# Altium project Super_Hornet_1.0.PrjPcb (part 2 of 5)
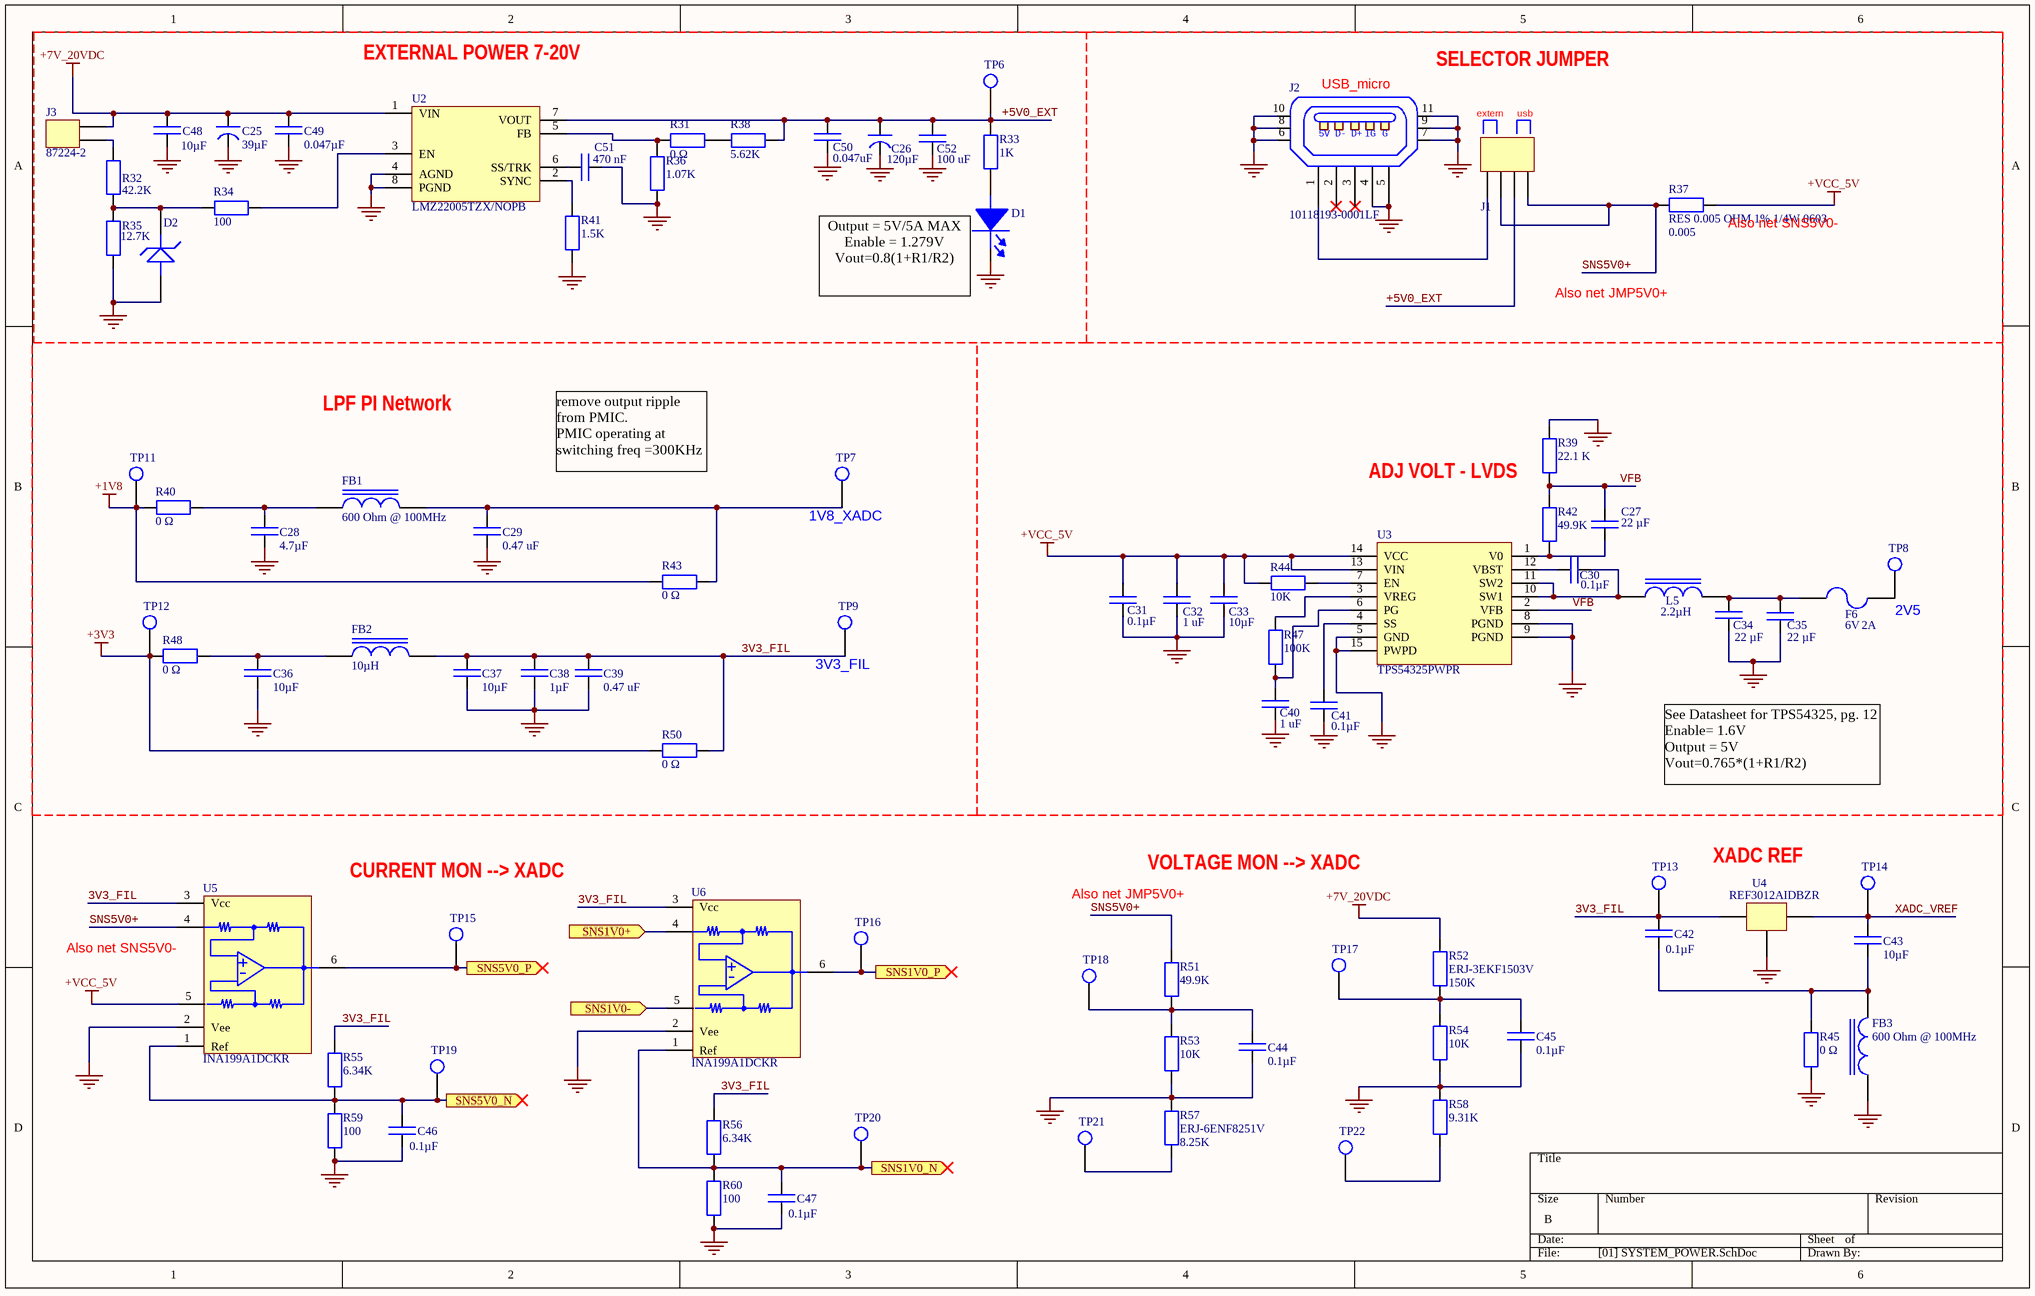
[diagram p3: [01] SYSTEM_POWER.SchDoc]

## Sheet [01] SYSTEM_POWER.SchDoc (continued)
### Library data of the parts
C25 = 35SVPF39M: CAP ALUM POLY 39UF 20% 35V SMD; Manufacturer: Panasonic; Featured Product: OS-CON Capacitors Hot New Technologies; EDA / CAD Models: Download from Accelerated Designs; ESR (Equivalent Series Resistance): 30 mOhm; Lifetime @ Temp.: 5000 Hrs @ 105°C; Polarization: Polar; Ripple Current: 2.8A; Surface Mount Land Size: 0.327" L x 0.327" W (8.30mm x 8.30mm); Online Catalog: OS-CON, SVPF Series; Other Names: P16561TR; Supplier 1: Digi-Key; Manufacturer Part Number: 35SVPF39M; Stock 1: 6908; Pricing 1: 1=1.51, 10=1.191, 100=0.8935, 500=0.6751 (USD); Standard Package: 1,000; Category: Capacitors; Family: Aluminum - Polymer Capacitors; Series: OS-CON, SVPF; Packaging: Tape & Reel (TR); Tolerance: ±20%; Voltage Rating: 35V; Operating Temperature: -55°C ~ 105°C; Size / Dimension: 0.315" Dia (8.00mm); Height - Seated (Max): 0.276" (7.00mm); Mounting Type: Surface Mount; Package / Case: Radial, Can - SMD; ComponentLink1URL: http://www.mouser.com/ds/2/315/AAB8000C177-947360.pdf?src-supplier=Mouser; ComponentLink1Description: http://www.mouser.com/ds/2/315/AAB8000C177-947360.pdf?src-supplier=Mouser; ComponentLink2URL: http://industrial.panasonic.com/cdbs/www-data/pdf/AAB8000/AAB8000C177.pdf?src-supplier=Element14; ComponentLink2Description: http://industrial.panasonic.com/cdbs/www-data/pdf/AAB8000/AAB8000C177.pdf?src-supplier=Element14; Supplier Part Number 1: P16561CT-ND
C26 = 20SVPF120M: CAP ALUM POLY 120UF 20% 20V SMD; Manufacturer: Panasonic; Featured Product: OS-CON Capacitors Hot New Technologies; EDA / CAD Models: Download from Accelerated Designs; ESR (Equivalent Series Resistance): 25 mOhm; Lifetime @ Temp.: 5000 Hrs @ 105°C; Polarization: Polar; Ripple Current: 3.2A; Surface Mount Land Size: 0.260" L x 0.260" W (6.60mm x 6.60mm); Online Catalog: OS-CON, SVPF Series; Other Names: P16498TR; Supplier 1: Digi-Key; Manufacturer Part Number: 20SVPF120M; Stock 1: 156; Pricing 1: 1=1.29, 10=1.022, 100=0.7662, 500=0.5789 (USD); Standard Package: 1,000; Category: Capacitors; Family: Aluminum - Polymer Capacitors; Series: OS-CON, SVPF; Packaging: Tape & Reel (TR); Tolerance: ±20%; Voltage Rating: 20V; Operating Temperature: -55°C ~ 105°C; Size / Dimension: 0.248" Dia (6.30mm); Height - Seated (Max): 0.236" (6.00mm); Mounting Type: Surface Mount; Package / Case: Radial, Can - SMD; ComponentLink1URL: http://industrial.panasonic.com/cdbs/www-data/pdf/AAB8000/AAB8000C177.pdf?src-supplier=Farnell; ComponentLink1Description: http://industrial.panasonic.com/cdbs/www-data/pdf/AAB8000/AAB8000C177.pdf?src-supplier=Farnell; ComponentLink2URL: http://www.alliedelec.com/images/products/datasheets/bm/Panasonic/70324301.pdf?src-supplier=Allied+Electronics; ComponentLink2Description: http://www.alliedelec.com/images/products/datasheets/bm/Panasonic/70324301.pdf?src-supplier=Allied+Electronics; ComponentLink3URL: http://www.farnell.com/datasheets/1734360.pdf?src-supplier=Element14; ComponentLink3Description: http://www.farnell.com/datasheets/1734360.pdf?src-supplier=Element14; Supplier Part Number 1: P16498CT-ND
C27 C34 C35 = 12063D226KAT2A: CAP CER 22UF 25V X5R 1206; Manufacturer: Kyocera AVX; Tolerance (%): ±10 %; Supplier 1: Digi-Key; Manufacturer Part Number: 12063D226KAT2A; Stock 1: 100747; Pricing 1: 1=1.15, 10=0.909, 100=0.6814, 500=0.5148, 1000=0.4543 (USD); Case Size/Dimension: 1206; Dielectric: X5R; Rated Voltage: 25 V; ComponentLink1URL: http://www.avx.com/docs/Catalogs/cx5r.pdf?src-supplier=Future+Electronics; ComponentLink1Description: http://www.avx.com/docs/Catalogs/cx5r.pdf?src-supplier=Future+Electronics; Supplier Part Number 1: 478-9946-1-ND
C28 = C2012X5R1C475K060AC: CAP CER 4.7UF 16V X5R 0805; Manufacturer: TDK; Product Training Modules: C Series General Applications SEAT, CCV, and TVCL Design Tools Guide to Replacing an Electrolytic Capacitor with an MLCC; EDA / CAD Models: Download from Accelerated Designs; Tolerance: ±10%; Online Catalog: C Series, General Purpose; Other Names: 445-14381-6; Supplier 1: Digi-Key; Manufacturer Part Number: C2012X5R1C475K060AC; Stock 1: 30385; Pricing 1: 1=0.5, 10=0.348, 100=0.2087, 500=0.1565, 1000=0.1322 (USD); RoHS Information: RoHS Certificate-MLCC; Standard Package: 1; Category: Capacitors; Family: Ceramic Capacitors; Series: C; Packaging: Digi-Reel®; Voltage - Rated: 16V; Temperature Coefficient: X5R; Mounting Type: Surface Mount, MLCC; Operating Temperature: -55°C ~ 85°C; Applications: General Purpose; Package / Case: 0805 (2012 Metric); Size / Dimension: 0.079" L x 0.049" W (2.00mm x 1.25mm); Thickness (Max): 0.030" (0.75mm); ComponentLink1URL: https://product.tdk.com/en/products/common/pdf/mlcc_partnumber_description.pdf?src-supplier=Digi-Key; ComponentLink1Description: https://product.tdk.com/en/products/common/pdf/mlcc_partnumber_description.pdf?src-supplier=Digi-Key; ComponentLink2URL: https://product.tdk.com/info/en/catalog/spec/mlccspec_commercial_general_midvoltage_en.pdf?src-supplier=Digi-Key; ComponentLink2Description: https://product.tdk.com/info/en/catalog/spec/mlccspec_commercial_general_midvoltage_en.pdf?src-supplier=Digi-Key; Supplier Part Number 1: 445-14381-1-ND
C29 C39 = GRM188R70J474KA01D: CAP CER 0.47UF 6.3V X7R 0603; Manufacturer: Murata; Voltage Rating DC: 6.3 VDC; Tolerance: 10 %; Brand: Murata Electronics; Case Height: 0.8 mm; Case Length: 1.6 mm; Type: General Purpose MLCC; Supplier 1: Digi-Key; Manufacturer Part Number: GRM188R70J474KA01D; Stock 1: 53423; Pricing 1: 1=0.19, 10=0.129, 100=0.0654, 500=0.0447, 1000=0.0396 (USD); Product Category: Multilayer Ceramic Capacitors MLCC - SMD/SMT; RoHS: Details; Dielectric: X7R; Case Code - mm: 1608; Minimum Operating Temperature: - 55 C; Maximum Operating Temperature: + 125 C; Termination Style: SMD/SMT; Product: General Type MLCCs; Case Width: 0.8 mm; Package / Case: 0603 (1608 metric); Packaging: Reel; Series: GRM; Factory Pack Quantity: 4000; ComponentLink1URL: https://www.murata.com/~/media/webrenewal/support/library/catalog/products/capacitor/mlcc/c02e.ashx?la=en-us&src-supplier=Digi-Key; ComponentLink1Description: https://www.murata.com/~/media/webrenewal/support/library/catalog/products/capacitor/mlcc/c02e.ashx?la=en-us&src-supplier=Digi-Key; ComponentLink2URL: http://psearch.murata.com/capacitor/product/GRM188R70J474KA01%23.pdf?src-supplier=Avnet; ComponentLink2Description: http://psearch.murata.com/capacitor/product/GRM188R70J474KA01%23.pdf?src-supplier=Avnet; Supplier Part Number 1: 490-6416-1-ND; Case Code - in: 0603
C30 C31 C41 = CC0402KRX7R6BB104: 0402 0.1 uF 10 V ±10 % Tolerance X7R SMT Multilayer Ceramic Capacitor; Manufacturer: Yageo; Product Training Modules: Multilayer Ceramic Capacitors; Catalog Drawings: CC_0402; Featured Product: Commodity Multilayer Ceramic Capacitors – CC Series; Tolerance: ±10%; Voltage - Rated: 10V; Online Catalog: CC Series; Other Names: 311-1345-6; Supplier 1: Digi-Key; Manufacturer Part Number: CC0402KRX7R6BB104; Stock 1: 1324566; Pricing 1: 1=0.1, 10=0.03, 100=0.0134, 500=0.0096, 1000=0.0075, 2500=0.0069, 5000=0.0063 (USD); Standard Package: 1; Category: Capacitors; Family: Ceramic Capacitors; Series: CC; Packaging: Digi-Reel®; Temperature Coefficient: X7R; Mounting Type: Surface Mount, MLCC; Operating Temperature: -55°C ~ 125°C; Applications: General Purpose; Ratings: -; Package / Case: 0402 (1005 Metric); Size / Dimension: 0.039" L x 0.020" W (1.00mm x 0.50mm); Height - Seated (Max): -; Thickness (Max): 0.022" (0.55mm); Lead Spacing: -; Features: -; Lead Style: -; ComponentLink1URL: http://www.mouser.com/ds/2/447/Yageo_UPY-GP_NP0_16V-to-50V_9-358835.pdf?src-supplier=Mouser; ComponentLink1Description: http://www.mouser.com/ds/2/447/Yageo_UPY-GP_NP0_16V-to-50V_9-358835.pdf?src-supplier=Mouser; ComponentLink2URL: https://www.verical.com/server-webapp/html/getDatasheet?partID=317655&src-supplier=Verical; ComponentLink2Description: https://www.verical.com/server-webapp/html/getDatasheet?partID=317655&src-supplier=Verical; ComponentLink3URL: http://www.farnell.com/datasheets/2167236.pdf?src-supplier=Element14; ComponentLink3Description: http://www.farnell.com/datasheets/2167236.pdf?src-supplier=Element14; ComponentLink4URL: http://www.yageo.com/documents/recent/UPY-GPHC_X7R_6.3V-to-50V_18.pdf?src-supplier=Digi-Key; ComponentLink4Description: http://www.yageo.com/documents/recent/UPY-GPHC_X7R_6.3V-to-50V_18.pdf?src-supplier=Digi-Key; ComponentLink5URL: http://www.yageo.com/documents/recent/UPY-GPHC_X7R_6.3V-to-50V_8.pdf?src-supplier=Avnet+Europe; ComponentLink5Description: http://www.yageo.com/documents/recent/UPY-GPHC_X7R_6.3V-to-50V_8.pdf?src-supplier=Avnet+Europe; Supplier Part Number 1: 311-1345-1-ND
C32 C40 = C0603C105K8RACTU: CAP CER 1UF 10V X7R 0603; Manufacturer: KEMET; Part # Aliases: C0603C105K8RAC7867; Capacitance - nF: 1000 nF; Case Height: 0.8 mm; Case Length: 1.6 mm; Class: Class 1; Dissipation Factor DF: 5; Tolerance: 10 %; Temperature Coefficient / Code: +/- 15 %; Type: SMD MLCC X7R 6.3 - 250 VDC Commerical Grade; Supplier 1: Digi-Key; Manufacturer Part Number: C0603C105K8RACTU; Stock 1: 413031; Pricing 1: 1=0.1, 10=0.064, 100=0.0285, 500=0.0204, 1000=0.016 (USD); Brand: Kemet; Case Code - in: 0603; Case Code - mm: 1608; Dimensions: 0.8 mm W x 1.6 mm L x 0.8 mm H; Dielectric: X7R; Case Width: 0.8 mm; Factory Pack Quantity: 4000; Voltage Rating: 10 V; Product Category: Multilayer Ceramic Capacitors MLCC - SMD/SMT; RoHS: Details; Voltage Rating DC: 10 V; Minimum Operating Temperature: - 55 C; Maximum Operating Temperature: + 125 C; Product: General Type MLCCs; Operating Temperature Range: - 55 C to + 125 C; Package / Case: 0603 (1608 metric); Packaging: Reel; Series: C0603C; Termination Style: SMD/SMT; ComponentLink1URL: https://www.verical.com/server-webapp/html/getDatasheet?partID=212378&src-supplier=Verical; ComponentLink1Description: https://www.verical.com/server-webapp/html/getDatasheet?partID=212378&src-supplier=Verical; Supplier Part Number 1: 399-11133-1-ND
C33 C36 C37 C43 = C3216X5R1C106M160AA: CAP CER 10UF 16V X5R 1206; Manufacturer: TDK; PCN Part Number: MLCC Part Number Change 30/Nov/2012; Product Training Modules: High Capacitance Replacement C Series General Applications SEAT, CCV, and TVCL Design Tools Guide to Replacing an Electrolytic Capacitor with an MLCC; Catalog Drawings: C SERIES_1206_1.8; Tolerance: ±20%; Online Catalog: C Series, General Purpose; Other Names: 445-1426-6; Supplier 1: Digi-Key; Manufacturer Part Number: C3216X5R1C106M160AA; Stock 1: 163411; Pricing 1: 1=0.33, 10=0.228, 100=0.129, 500=0.0911, 1000=0.0797 (USD); RoHS Information: RoHS Certificate-MLCC; Standard Package: 1; Category: Capacitors; Family: Ceramic Capacitors; Series: C; Packaging: Digi-Reel®; Voltage - Rated: 16V; Temperature Coefficient: X5R; Mounting Type: Surface Mount, MLCC; Operating Temperature: -55°C ~ 85°C; Applications: General Purpose; Ratings: -; Package / Case: 1206 (3216 Metric); Size / Dimension: 0.126" L x 0.063" W (3.20mm x 1.60mm); Height - Seated (Max): -; Thickness (Max): 0.071" (1.80mm); Lead Spacing: -; Features: -; Lead Style: -; ComponentLink1URL: http://www.farnell.com/datasheets/1359284.pdf?src-supplier=Element14; ComponentLink1Description: http://www.farnell.com/datasheets/1359284.pdf?src-supplier=Element14; ComponentLink2URL: http://www.mouser.com/ds/2/400/lcc_commercial_general_en-837201.pdf?src-supplier=Mouser; ComponentLink2Description: http://www.mouser.com/ds/2/400/lcc_commercial_general_en-837201.pdf?src-supplier=Mouser; ComponentLink3URL: http://www.farnell.com/datasheets/1796654.pdf?src-supplier=Element14; ComponentLink3Description: http://www.farnell.com/datasheets/1796654.pdf?src-supplier=Element14; ComponentLink4URL: https://product.tdk.com/info/en/documents/chara_sheet/C3216X5R1C106M160AA.pdf?src-supplier=Digi-Key; ComponentLink4Description: https://product.tdk.com/info/en/documents/chara_sheet/C3216X5R1C106M160AA.pdf?src-supplier=Digi-Key; Supplier Part Number 1: 445-1426-1-ND
C38 = C3216X7R1H105K160AE: CAP CER 1UF 50V X7R 1206; Manufacturer: TDK; PCN Part Number: MLCC Part Number Change 30/Nov/2012; Product Training Modules: SEAT, CCV, and TVCL Design Tools C Series Soft Termination Capacitor Family Guide to Replacing an Electrolytic Capacitor with an MLCC; Featured Product: Soft Termination MLCC; Tolerance: ±10%; Online Catalog: C Series, Soft Termination; Other Names: 445-8904-6; Supplier 1: Digi-Key; Manufacturer Part Number: C3216X7R1H105K160AE; Stock 1: 71650; Pricing 1: 1=0.37, 10=0.26, 100=0.1558, 500=0.1168, 1000=0.0987 (USD); RoHS Information: RoHS Certificate-MLCC; Standard Package: 1; Category: Capacitors; Family: Ceramic Capacitors; Series: C; Packaging: Digi-Reel®; Voltage - Rated: 50V; Temperature Coefficient: X7R; Mounting Type: Surface Mount, MLCC; Operating Temperature: -55°C ~ 125°C; Applications: Boardflex Sensitive; Ratings: -; Package / Case: 1206 (3216 Metric); Size / Dimension: 0.126" L x 0.063" W (3.20mm x 1.60mm); Height - Seated (Max): -; Thickness (Max): 0.063" (1.60mm); Lead Spacing: -; Features: Soft Termination; Lead Style: -; ComponentLink1URL: http://www.mouser.com/ds/2/400/tdk_mlcc_commercial_general_en-542463.pdf?src-supplier=Mouser; ComponentLink1Description: http://www.mouser.com/ds/2/400/tdk_mlcc_commercial_general_en-542463.pdf?src-supplier=Mouser; Supplier Part Number 1: 445-8904-1-ND
C42 C44-C47 = CC0402KRX7R6BB104: CAP CER 0.1UF 10V X7R 0402; Manufacturer: Yageo; Product Training Modules: Multilayer Ceramic Capacitors; Catalog Drawings: CC_0402; Featured Product: Commodity Multilayer Ceramic Capacitors – CC Series; Tolerance: ±10%; Online Catalog: CC Series; Other Names: 311-1345-6; Supplier 1: Digi-Key; Manufacturer Part Number: CC0402KRX7R6BB104; Stock 1: 1324566; Pricing 1: 1=0.1, 10=0.03, 100=0.0134, 500=0.0096, 1000=0.0075, 2500=0.0069, 5000=0.0063 (USD); Standard Package: 1; Category: Capacitors; Family: Ceramic Capacitors; Series: CC; Packaging: Digi-Reel®; Voltage - Rated: 10V; Temperature Coefficient: X7R; Mounting Type: Surface Mount, MLCC; Operating Temperature: -55°C ~ 125°C; Applications: General Purpose; Ratings: -; Package / Case: 0402 (1005 Metric); Size / Dimension: 0.039" L x 0.020" W (1.00mm x 0.50mm); Height - Seated (Max): -; Thickness (Max): 0.022" (0.55mm); Lead Spacing: -; Features: -; Lead Style: -; ComponentLink1URL: http://www.mouser.com/ds/2/447/Yageo_UPY-GP_NP0_16V-to-50V_9-358835.pdf?src-supplier=Mouser; ComponentLink1Description: http://www.mouser.com/ds/2/447/Yageo_UPY-GP_NP0_16V-to-50V_9-358835.pdf?src-supplier=Mouser; ComponentLink2URL: https://www.verical.com/server-webapp/html/getDatasheet?partID=317655&src-supplier=Verical; ComponentLink2Description: https://www.verical.com/server-webapp/html/getDatasheet?partID=317655&src-supplier=Verical; ComponentLink3URL: http://www.farnell.com/datasheets/2167236.pdf?src-supplier=Element14; ComponentLink3Description: http://www.farnell.com/datasheets/2167236.pdf?src-supplier=Element14; ComponentLink4URL: http://www.yageo.com/documents/recent/UPY-GPHC_X7R_6.3V-to-50V_18.pdf?src-supplier=Digi-Key; ComponentLink4Description: http://www.yageo.com/documents/recent/UPY-GPHC_X7R_6.3V-to-50V_18.pdf?src-supplier=Digi-Key; ComponentLink5URL: http://www.yageo.com/documents/recent/UPY-GPHC_X7R_6.3V-to-50V_8.pdf?src-supplier=Avnet+Europe; ComponentLink5Description: http://www.yageo.com/documents/recent/UPY-GPHC_X7R_6.3V-to-50V_8.pdf?src-supplier=Avnet+Europe; Supplier Part Number 1: 311-1345-1-ND
C48 = GRM188R6YA106MA73D: CAP CER 10UF 35V X5R 0603; Manufacturer: Murata; Tolerance: ±20%; Supplier 1: Digi-Key; Manufacturer Part Number: GRM188R6YA106MA73D; Stock 1: 122766; Pricing 1: 1=0.48, 10=0.331, 50=0.2316, 100=0.1986, 500=0.1489, 1000=0.1258 (USD); Category: Capacitors; Family: Ceramic Capacitors; Series: GRM; Packaging: Tape & Reel (TR); Voltage - Rated: 35V; Temperature Coefficient: X5R; Mounting Type: Surface Mount, MLCC; Operating Temperature: -55°C ~ 85°C; Applications: General Purpose; Ratings: -; Package / Case: 0603 (1608 Metric); Size / Dimension: 0.063" L x 0.031" W (1.60mm x 0.80mm); Height - Seated (Max): -; Thickness (Max): 0.039" (1.00mm); Lead Spacing: -; Features: Derating Recommended; Lead Style: -; ComponentLink1URL: http://search.murata.co.jp/Ceramy/image/img/A01X/G101/ENG/GRM188R6YA106MA73-01.pdf?src-supplier=Digi-Key; ComponentLink1Description: http://search.murata.co.jp/Ceramy/image/img/A01X/G101/ENG/GRM188R6YA106MA73-01.pdf?src-supplier=Digi-Key; ComponentLink2URL: http://search.murata.co.jp/Ceramy/image/img/A01X/G101/ENG/GRM188R6YA106MA73-01.pdf?src-supplier=Mouser; ComponentLink2Description: http://search.murata.co.jp/Ceramy/image/img/A01X/G101/ENG/GRM188R6YA106MA73-01.pdf?src-supplier=Mouser; ComponentLink3URL: https://www.murata.com/~/media/webrenewal/support/library/catalog/products/capacitor/mlcc/c02e.ashx?la=en-us&src-supplier=Digi-Key; ComponentLink3Description: https://www.murata.com/~/media/webrenewal/support/library/catalog/products/capacitor/mlcc/c02e.ashx?la=en-us&src-supplier=Digi-Key; ComponentLink4URL: http://search.murata.co.jp/Ceramy/image/img/A01X/G101/ENG/GRM188R6YA106MA73-01.pdf?src-supplier=Future+Electronics; ComponentLink4Description: http://search.murata.co.jp/Ceramy/image/img/A01X/G101/ENG/GRM188R6YA106MA73-01.pdf?src-supplier=Future+Electronics; ComponentLink5URL: http://search.murata.co.jp/Ceramy/image/img/A01X/G101/ENG/GRM188R6YA106MA73-01.pdf?src-supplier=TTI; ComponentLink5Description: http://search.murata.co.jp/Ceramy/image/img/A01X/G101/ENG/GRM188R6YA106MA73-01.pdf?src-supplier=TTI; Supplier Part Number 1: 490-13248-1-ND
C49 = GMK107BJ473KAHT: CAP CER 0.047UF 35V X5R 0603; Manufacturer: Taiyo Yuden; Unit PriceUSD: M; Dynamic Catalog: M Series; Featured Product: Multilayer Chip Capacitors; Tolerance: ±10%; Other Names: 587-3361-6; Supplier 1: Digi-Key; Manufacturer Part Number: GMK107BJ473KAHT; Stock 1: 7209; Pricing 1: 1=0.11, 10=0.079, 50=0.0446, 100=0.037, 500=0.0259, 1000=0.0215 (USD); Quantity Available: Digi-Reel®Alternate Packaging; Package/Case: 0603 (1608 Metric); Standard Package: 1; Category: Capacitors; Family: Ceramic Capacitors; Series: M; Packaging: Digi-Reel®; Capacitance: 0.047µF; Voltage - Rated: 35V; Temperature Coefficient: X5R; Mounting Type: Surface Mount, MLCC; Operating Temperature: -55°C ~ 85°C; Applications: Automotive; Ratings: AEC-Q200; Package / Case: 0603 (1608 Metric); Size / Dimension: 0.063" L x 0.031" W (1.60mm x 0.80mm); Thickness (Max): 0.035" (0.90mm); Online Catalog: M Series; ComponentLink1URL: https://www.yuden.co.jp/productdata/catalog/mlcc06_hq_e.pdf?src-supplier=Digi-Key; ComponentLink1Description: https://www.yuden.co.jp/productdata/catalog/mlcc06_hq_e.pdf?src-supplier=Digi-Key; ComponentLink2URL: http://ds.yuden.co.jp/TYCOMPAS/ut/detail.do?productNo=GMK107BJ473KAHT&fileName=GMK107BJ473KAHT_SS&mode=specSheetDownload&src-supplier=Digi-Key; ComponentLink2Description: http://ds.yuden.co.jp/TYCOMPAS/ut/detail.do?productNo=GMK107BJ473KAHT&fileName=GMK107BJ473KAHT_SS&mode=specSheetDownload&src-supplier=Digi-Key; Supplier Part Number 1: 587-3361-1-ND
C50 = C0603C473K8RAC7867: CAP CER 0.047UF 10V X7R 0603; Manufacturer: KEMET; Rad Hard: No; Product Depth: 0.8 mm; Voltage: 10 Vdc; Tolerance: 10 %; Product Length: 1.6 mm; Supplier 1: Digi-Key; Manufacturer Part Number: C0603C473K8RAC7867; Stock 1: 19838; Pricing 1: 1=0.17, 10=0.118, 100=0.0554, 500=0.0389, 1000=0.0322 (USD); Package/Case: 0603; Mounting: Surface Mount; Dielectric: X7R; Operating Temperature: -55 to 125 °C; Construction: Flat; Product Height: 0.8 mm; Category: Capacitor Ceramic Multilayer; ComponentLink1URL: https://api.kemet.com/component-edge/download/datasheet/C0603C473K8RACTU.pdf?src-supplier=Digi-Key; ComponentLink1Description: https://api.kemet.com/component-edge/download/datasheet/C0603C473K8RACTU.pdf?src-supplier=Digi-Key; ComponentLink2URL: http://capacitoredge.kemet.com/capedge2/DataSheet?pn=C0603C473K8RACTU&src-supplier=Avnet+Europe; ComponentLink2Description: http://capacitoredge.kemet.com/capedge2/DataSheet?pn=C0603C473K8RACTU&src-supplier=Avnet+Europe; ComponentLink3URL: http://components.arrow.com/part/dataview/0323_00323325?src-supplier=Arrow+Europe; ComponentLink3Description: http://components.arrow.com/part/dataview/0323_00323325?src-supplier=Arrow+Europe; Supplier Part Number 1: 399-14522-1-ND
C51 = 0805YC474KAT2A: CAP CER 0.47UF 16V X7R 0805; Manufacturer: Kyocera AVX; Tolerance (%): ±10 %; Supplier 1: Digi-Key; Manufacturer Part Number: 0805YC474KAT2A; Stock 1: 203194; Pricing 1: 1=0.25, 10=0.173, 50=0.104, 100=0.0878, 500=0.0601, 1000=0.0531 (USD); Case Size/Dimension: 0805; Dielectric: X7R; Rated Voltage: 16 V; ComponentLink1URL: http://uk.rs-online.com/webdocs/0ed4/0900766b80ed4be2.pdf?src-supplier=RSComponents; ComponentLink1Description: http://uk.rs-online.com/webdocs/0ed4/0900766b80ed4be2.pdf?src-supplier=RSComponents; ComponentLink2URL: http://www.mouser.com/ds/2/40/X7RDielectric-777024.pdf?src-supplier=Mouser; ComponentLink2Description: http://www.mouser.com/ds/2/40/X7RDielectric-777024.pdf?src-supplier=Mouser; ComponentLink3URL: https://www.alliedelec.com/m/d/a24bb5190bea413b2ff164816f55e87c.pdf?src-supplier=Allied+Electronics; ComponentLink3Description: https://www.alliedelec.com/m/d/a24bb5190bea413b2ff164816f55e87c.pdf?src-supplier=Allied+Electronics; ComponentLink4URL: http://www.avx.com/docs/Catalogs/cx7r.pdf?src-supplier=Future+Electronics; ComponentLink4Description: http://www.avx.com/docs/Catalogs/cx7r.pdf?src-supplier=Future+Electronics; ComponentLink5URL: http://www.jameco.com/Jameco/Products/ProdDS/2011221.pdf?src-supplier=Jameco; ComponentLink5Description: http://www.jameco.com/Jameco/Products/ProdDS/2011221.pdf?src-supplier=Jameco; ComponentLink6URL: http://www.avx.com/docs/catalogs/cx7r.pdf?src-supplier=Avnet+Europe; ComponentLink6Description: http://www.avx.com/docs/catalogs/cx7r.pdf?src-supplier=Avnet+Europe; ComponentLink7URL: http://www.avx.com/docs/catalogs/cx7r.pdf?src-supplier=Avnet; ComponentLink7Description: http://www.avx.com/docs/catalogs/cx7r.pdf?src-supplier=Avnet; ComponentLink8URL: http://catalogs.avx.com/SurfaceMount.pdf?src-supplier=Digi-Key; ComponentLink8Description: http://catalogs.avx.com/SurfaceMount.pdf?src-supplier=Digi-Key; ComponentLink9URL: http://datasheets.avx.com/AutoMLCC.pdf?src-supplier=Avnet+Asia; ComponentLink9Description: http://datasheets.avx.com/AutoMLCC.pdf?src-supplier=Avnet+Asia; ComponentLink10URL: http://datasheets.avx.com/X7RDielectric.pdf?src-supplier=Digi-Key; ComponentLink10Description: http://datasheets.avx.com/X7RDielectric.pdf?src-supplier=Digi-Key; ComponentLink11URL: http://avx.com/docs/Catalogs/cx7r.pdf?src-supplier=Element14; ComponentLink11Description: http://avx.com/docs/Catalogs/cx7r.pdf?src-supplier=Element14; Supplier Part Number 1: 478-1403-1-ND
C52 = GRM31CR60J107ME39K: CAP CER 100UF 6.3V X5R 1206; Manufacturer: Murata; Rad Hard: No; Product Depth: 1.6 mm; Voltage: 6.3 Vdc; Tolerance: 20 %; Product Length: 3.2 mm; Supplier 1: Digi-Key; Manufacturer Part Number: GRM31CR60J107ME39K; Stock 1: 190642; Pricing 1: 1=1.08, 10=0.852, 100=0.6387, 500=0.4826, 1000=0.4258, 2500=0.3974 (USD); Packaging: Tape & Reel; Package/Case: 1206; Mounting: Surface Mount; Dielectric: X5R; Operating Temperature: -55 to 85 °C; Construction: Flat; Product Height: 1.6 mm; Category: Capacitor Ceramic Multilayer; ComponentLink1URL: http://www.mouser.com/ds/2/281/GRM31A7U2H471JW31-01-1064911.pdf?src-supplier=Mouser; ComponentLink1Description: http://www.mouser.com/ds/2/281/GRM31A7U2H471JW31-01-1064911.pdf?src-supplier=Mouser; ComponentLink2URL: https://www.murata.com/~/media/webrenewal/support/library/catalog/products/capacitor/mlcc/c02e.ashx?la=en-us&src-supplier=Digi-Key; ComponentLink2Description: https://www.murata.com/~/media/webrenewal/support/library/catalog/products/capacitor/mlcc/c02e.ashx?la=en-us&src-supplier=Digi-Key; Supplier Part Number 1: 490-7217-1-ND
D1 = SML-LXFP0603USBCTR: LED BLUE CLEAR 0603 SMD; Manufacturer: Lumex; Wavelength/Color Temperature: 470 nm; Luminous Intensity: 70 mcd; Viewing Angle: 130 deg; Lens Color/Style: Water Clear; If - Forward Current: 5 mA; Vf - Forward Voltage: 3 V; Power Rating: 95 mW; LED Size: 1.6 mm x 0.8 mm x 0.2 mm; Lens Shape: Rectangular; Vr - Reverse Voltage: 5 V; Supplier 1: Digi-Key; Manufacturer Part Number: SML-LXFP0603USBCTR; Stock 1: 9920; Pricing 1: 1=0.77, 10=0.595, 100=0.3825, 500=0.323, 1000=0.255 (USD); Product Category: Standard LEDs - SMD; RoHS: True; Package / Case: 0603 (1608 metric); Illumination Color: Blue; Length: 1.6 mm; Height: 0.2 mm; Width: 0.8 mm; Maximum Operating Temperature: + 85 C; Minimum Operating Temperature: - 40 C; Series: FP0603; Packaging: Reel; Brand: Lumex; Lens Dimensions: 1.6 mm x 0.8 mm; Mounting Style: SMD/SMT; Peak Wavelength: 470 nm; Factory Pack Quantity: 3000; Wavelength: 470 nm; ComponentLink1URL: http://www.lumex.com/content/files/ProductAttachment/SML-LXFP0603USBCTR.pdf?src-supplier=Digi-Key; ComponentLink1Description: http://www.lumex.com/content/files/ProductAttachment/SML-LXFP0603USBCTR.pdf?src-supplier=Digi-Key; ComponentLink2URL: https://www.lumex.com/content/files/ProductAttachment/SML-LXFP0603USBCTR.pdf?src-supplier=Digi-Key; ComponentLink2Description: https://www.lumex.com/content/files/ProductAttachment/SML-LXFP0603USBCTR.pdf?src-supplier=Digi-Key; ComponentLink3URL: http://www.mouser.com/ds/2/244/SML-LXFP0603USBCTR-272434.pdf?src-supplier=Mouser; ComponentLink3Description: http://www.mouser.com/ds/2/244/SML-LXFP0603USBCTR-272434.pdf?src-supplier=Mouser; Supplier Part Number 1: 67-2225-1-ND
D2 = MMSZ5231BS-7-F: DIODE ZENER 5.1V 200MW SOD323; Manufacturer: Diodes; Voltage Tolerance: 5 %; Zener Current: 5 uA; Zz - Zener Impedance: 17 Ohms; Configuration: Single; Brand: Diodes Incorporated; Vf - Forward Voltage: 0.9 V at 10 mA; Unit Weight: 0.000173 oz; Supplier 1: Digi-Key; Manufacturer Part Number: MMSZ5231BS-7-F; Stock 1: 36123; Pricing 1: 1=0.26, 10=0.182, 100=0.097, 500=0.0556, 1000=0.0465 (USD); Product Category: Zener Diodes; RoHS: True; Vz - Zener Voltage: 5.1 V; Mounting Style: SMD/SMT; Package / Case: SOD-323-2; Pd - Power Dissipation: 200 mW; Maximum Operating Temperature: + 150 C; Packaging: Reel; Height: 1 mm; Ir - Reverse Current: 5 uA; Length: 2.7 mm; Minimum Operating Temperature: - 65 C; Product: Zener Diode; Series: MMSZ523; Factory Pack Quantity: 3000; Termination Style: SMD/SMT; Width: 1.4 mm; ComponentLink1URL: http://www.diodes.com/datasheets/ds31038.pdf?src-supplier=Future+Electronics; ComponentLink1Description: http://www.diodes.com/datasheets/ds31038.pdf?src-supplier=Future+Electronics; ComponentLink2URL: http://www.diodes.com///datasheets/ds31038.pdf?src-supplier=Avnet; ComponentLink2Description: http://www.diodes.com///datasheets/ds31038.pdf?src-supplier=Avnet; ComponentLink3URL: http://www.diodes.com//datasheets/ds31038.pdf?src-supplier=Avnet; ComponentLink3Description: http://www.diodes.com//datasheets/ds31038.pdf?src-supplier=Avnet; ComponentLink4URL: http://www.diodes.com//datasheets/ds31038.pdf?src-supplier=Avnet+Europe; ComponentLink4Description: http://www.diodes.com//datasheets/ds31038.pdf?src-supplier=Avnet+Europe; Supplier Part Number 1: MMSZ5231BS-FDICT-ND
F6 = MF-NSML200-2: PTC FUSE 2A HOLD 4ATRIP 6V 50A 0.8W 1s; Manufacturer: Bourns; Categories: Circuit Protection; Type: Polymeric; Current - Trip (It): 4A; Resistance - Initial (Ri) (Min): 5 mOhms; Resistance - Post Trip (R1) (Max): 25 mOhms; Approvals: cURus, TUV; Supplier 1: Digi-Key; Manufacturer Part Number: MF-NSML200-2; Stock 1: 3983; Pricing 1: 1=0.95, 5=0.92, 10=0.861, 50=0.7128, 100=0.594, 250=0.5792, 500=0.4901, 1000=0.4307 (USD); Series: Multifuse®, MF-NSML; Packaging: Cut Tape (CT); Part Status: Active; Current - Max: 50A; Time to Trip: 1s; Operating Temperature: -40°C ~ 85°C; Ratings: -; Mounting Type: Surface Mount; Package / Case: 1206 (3216 Metric), Concave; Size / Dimension: 0.128 L x 0.063 W (3.25mm x 1.60mm); Height - Seated (Max): -; Thickness (Max): 0.024 (0.60mm); Lead Spacing: -; ComponentLink1URL: https://www.bourns.com/docs/Product-Datasheets/mfnsml.pdf?src-supplier=Digi-Key; ComponentLink1Description: https://www.bourns.com/docs/Product-Datasheets/mfnsml.pdf?src-supplier=Digi-Key; Supplier Part Number 1: MF-NSML200-2CT-ND
FB1 FB3 = HZ0805E601R-10: Manufacturer: Laird; Catalog Drawings: (HI,HZ,LI,MI)0805 Series_1.10mm Max. Height; Filter Type: Signal Line; Number of Lines: 1; Current Rating (Max): 500mA; DC Resistance (DCR) (Max): 300 mOhm; Online Catalog: HZ Series; Kits: 240-2227-ND  - KIT EMI FERRITE BEAD CHIP SMD; Other Names: 240-2399-1; Supplier 1: Digi-Key; Manufacturer Part Number: HZ0805E601R-10; Stock 1: 529301; Pricing 1: 1=0.17, 10=0.141, 25=0.1096, 50=0.0908, 100=0.0783, 250=0.0626, 500=0.0563, 1000=0.047 (USD); Standard Package: 1; Category: Filters; Family: Ferrite Beads and Chips; Series: HZ; Packaging: Cut Tape (CT); Ratings: -; Operating Temperature: -40°C ~ 125°C; Package / Case: 0805 (2012 Metric); Mounting Type: Surface Mount; Height (Max): 0.043" (1.10mm); Size / Dimension: 0.079" L x 0.049" W (2.00mm x 1.25mm); ComponentLink1URL: http://www.farnell.com/datasheets/1685710.pdf?src-supplier=Element14; ComponentLink1Description: http://www.farnell.com/datasheets/1685710.pdf?src-supplier=Element14; ComponentLink2URL: https://assets.lairdtech.com/home/brandworld/files/HZ0805E601R-10.pdf?src-supplier=Digi-Key; ComponentLink2Description: https://assets.lairdtech.com/home/brandworld/files/HZ0805E601R-10.pdf?src-supplier=Digi-Key; ComponentLink3URL: http://lairdtech.thomasnet.com/Asset/HZ0805E601R-10-A-VP.pdf?src-supplier=Avnet; ComponentLink3Description: http://lairdtech.thomasnet.com/Asset/HZ0805E601R-10-A-VP.pdf?src-supplier=Avnet; ComponentLink4URL: https://www.alliedelec.com/m/d/63159f83fbe70e1160794b0cc8ac128f.pdf?src-supplier=Allied+Electronics; ComponentLink4Description: https://www.alliedelec.com/m/d/63159f83fbe70e1160794b0cc8ac128f.pdf?src-supplier=Allied+Electronics; Supplier Part Number 1: 240-2399-1-ND
FB2 = MLZ2012N100LT000: IND 10UH 500MA 300 MOHM; Manufacturer: TDK; Product Training Modules: SMD Inductors; EDA / CAD Models: Download from Accelerated Designs; Type: Multilayer; Material - Core: Ferrite; Tolerance: ±20%; Current - Saturation: 110mA; Shielding: Shielded; DC Resistance (DCR): 390 mOhm Max; Frequency - Self Resonant: 50MHz; Frequency - Test: 2MHz; Online Catalog: MLZ Series; Other Names: 445-6762-6; Supplier 1: Digi-Key; Manufacturer Part Number: MLZ2012N100LT000; Stock 1: 55210; Pricing 1: 1=0.14, 10=0.129, 100=0.0863, 500=0.0719, 1000=0.0604 (USD); Standard Package: 1; Category: Inductors, Coils, Chokes; Family: Fixed Inductors; Series: MLZ; Packaging: Digi-Reel®; Current Rating: 500mA; Q @ Freq: -; Ratings: -; Operating Temperature: -55°C ~ 125°C; Mounting Type: Surface Mount; Package / Case: 0805 (2012 Metric); Size / Dimension: 0.079" L x 0.049" W (2.00mm x 1.25mm); Height - Seated (Max): 0.057" (1.45mm); ComponentLink1URL: https://product.tdk.com/info/en/catalog/datasheets/inductor_commercial_decoupling_mlz2012_en.pdf?src-supplier=Digi-Key; ComponentLink1Description: https://product.tdk.com/info/en/catalog/datasheets/inductor_commercial_decoupling_mlz2012_en.pdf?src-supplier=Digi-Key; Supplier Part Number 1: 445-6762-1-ND
J1 = PRPC004SAAN-RC: CONN HEADER VERT 4POS 2.54MM; Manufacturer: Sullins; Connector Type: Header, Unshrouded, Breakaway; Number of Positions: 4; Number of Positions Loaded: All; Pitch: 0.100" (2.54mm); Online Catalog: 0.100" (2.54mm) Pitch Connector Headers; Other Names: S9510E-04  S9510E-04-ND; Supplier 1: Digi-Key; Manufacturer Part Number: PRPC004SAAN-RC; Stock 1: 6923; Pricing 1: 1=0.15, 10=0.146, 25=0.1084, 50=0.0928, 100=0.0898, 250=0.0774, 500=0.0743 (USD); Standard Package: 1; Category: Connectors, Interconnects; Family: Rectangular Connectors - Headers, Male Pins; Series: -; Packaging: Bulk; Contact Type: Male Pin; Number of Rows: 1; Row Spacing: -; Contact Mating Length: 0.230" (5.84mm); Mounting Type: Through Hole; Termination: Solder; Fastening Type: -; Features: -; Contact Finish: Gold; Contact Finish Thickness: Flash; Color: Black; ComponentLink1URL: https://media.digikey.com/PDF/Data%20Sheets/Sullins%20PDFs/xRxCzzzSxxN-RC_ST_11635-B.pdf?src-supplier=Digi-Key; ComponentLink1Description: https://media.digikey.com/PDF/Data%20Sheets/Sullins%20PDFs/xRxCzzzSxxN-RC_ST_11635-B.pdf?src-supplier=Digi-Key; Supplier Part Number 1: S1011EC-04-ND
J2 = 10118193-0001LF_1: USB - micro B USB 2.0 Receptacle Connector 5 Position Surface Mount, Right Angle, Horizontal; Manufacturer: Amphenol FCI; Number of Contacts: 5 Contact; Gender: Female; Current Rating: 1.8 A; Brand: FCI; Connector Type: Micro USB Type B receptacle; Insulation Resistance: 1000 MOhms; Supplier 1: Mouser; Stock 1: 78930; Pricing 1: 1=0.44, 10=0.304, 50=0.304, 100=0.292, 1000=0.251, 10000=0.179 (USD); Product Category: USB Connectors; RoHS: Details; Product: Micro USB Type B Connectors; Standard: USB 2.0; Termination Style: SMD/SMT; Color: Black; Contact Material: Copper Alloy; Contact Plating: Gold; Flammability Rating: UL 94 V-0; Mounting Angle: Right; Operating Temperature Range: - 55 C to + 85 C; Packaging: Reel; Factory Pack Quantity: 1200; ComponentLink1URL: https://cdn.amphenol-icc.com/media/wysiwyg/files/documentation/datasheet/inputoutput/io_usb_micro.pdf?src-supplier=Digi-Key; ComponentLink1Description: https://cdn.amphenol-icc.com/media/wysiwyg/files/documentation/datasheet/inputoutput/io_usb_micro.pdf?src-supplier=Digi-Key; ComponentLink2URL: https://cdn.amphenol-icc.com/media/wysiwyg/files/documentation/datasheet/inputoutput/io_usb_micro.pdf?src-supplier=Arrow; ComponentLink2Description: https://cdn.amphenol-icc.com/media/wysiwyg/files/documentation/datasheet/inputoutput/io_usb_micro.pdf?src-supplier=Arrow; ComponentLink3URL: http://www.amphenol-icc.com/media/wysiwyg/files/drawing/10118193.pdf?src-supplier=Digi-Key; ComponentLink3Description: http://www.amphenol-icc.com/media/wysiwyg/files/drawing/10118193.pdf?src-supplier=Digi-Key; ComponentLink4URL: https://cdn.amphenol-icc.com/media/wysiwyg/files/documentation/datasheet/inputoutput/io_usb_micro.pdf?src-supplier=Verical; ComponentLink4Description: https://cdn.amphenol-icc.com/media/wysiwyg/files/documentation/datasheet/inputoutput/io_usb_micro.pdf?src-supplier=Verical; ComponentLink5URL: https://cdn.amphenol-icc.com/media/wysiwyg/files/documentation/datasheet/inputoutput/io_usb_micro.pdf?src-supplier=Allied+Electronics; ComponentLink5Description: https://cdn.amphenol-icc.com/media/wysiwyg/files/documentation/datasheet/inputoutput/io_usb_micro.pdf?src-supplier=Allied+Electronics; ComponentLink6URL: https://cdn.amphenol-icc.com/media/wysiwyg/files/documentation/datasheet/inputoutput/io_usb_micro.pdf?src-supplier=Mouser; ComponentLink6Description: https://cdn.amphenol-icc.com/media/wysiwyg/files/documentation/datasheet/inputoutput/io_usb_micro.pdf?src-supplier=Mouser; Supplier Part Number 1: 649-10118193-0001LF; Manufacturer Part Number: 10118193-0001LF
J3 = 87224-2: CONN HEADER VERT 2POS 2.54MM; Manufacturer: TE Connectivity; Catalog Drawings: Single Square Straight Post / Single Square Straight Post Side; Featured Product: AMPMODU Connectors; 3D Model: 87224-2.pdf; Connector Type: Header, Unshrouded; Number of Positions: 2; Number of Positions Loaded: All; Pitch: 0.100" (2.54mm); Dynamic Catalog: AMPMODU Mod II Series; Mating Products: A26921-ND / - CONN HOUSING 2POS .100 LOCKING / A26963-ND / - CONN HOUSING 2POS .100 SINGLE / A3011-ND / - CONN HOUSING 2POS .100 SINGLE; Other Names: 87224-2-ND / A26543; Supplier 1: Digi-Key; Manufacturer Part Number: 87224-2; Stock 1: 17290; Pricing 1: 1=1.01, 10=0.886, 100=0.7644, 500=0.6254, 1000=0.5559, 5000=0.4864, 10000=0.4621 (USD); RoHS Information: 87224-2 Statement of Compliance; Standard Package: 500; Category: Connectors, Interconnects; Family: Rectangular Connectors - Headers, Male Pins; Series: AMPMODU Mod II; Contact Type: Male Pin; Number of Rows: 1; Contact Mating Length: 0.318" (8.08mm); Mounting Type: Through Hole; Termination: Solder; Contact Finish: Gold; Contact Finish Thickness: 15µin (0.38µm); Color: Black; Packaging: Bulk; ComponentLink1URL: http://www1.futureelectronics.com/doc/TYCO%20ELECTRONICS/87224-2.pdf?src-supplier=Future+Electronics; ComponentLink1Description: http://www1.futureelectronics.com/doc/TYCO%20ELECTRONICS/87224-2.pdf?src-supplier=Future+Electronics; ComponentLink2URL: http://www.te.com/commerce/DocumentDelivery/DDEController?Action=srchrtrv&DocNm=1307819_AMPMODU&DocType=DS&DocLang=English&s_cid=1046&src-supplier=Avnet; ComponentLink2Description: http://www.te.com/commerce/DocumentDelivery/DDEController?Action=srchrtrv&DocNm=1307819_AMPMODU&DocType=DS&DocLang=English&s_cid=1046&src-supplier=Avnet; ComponentLink3URL: http://www.jameco.com/Jameco/Products/ProdDS/1934518.pdf?src-supplier=Jameco; ComponentLink3Description: http://www.jameco.com/Jameco/Products/ProdDS/1934518.pdf?src-supplier=Jameco; ComponentLink4URL: http://www.tycoelectronics.com/commerce/DocumentDelivery/DDEController?Action=srchrtrv&DocNm=1307819_SECTION_5&DocType=Catalog+Section&DocLang=English&src-supplier=Element14; ComponentLink4Description: http://www.tycoelectronics.com/commerce/DocumentDelivery/DDEController?Action=srchrtrv&DocNm=1307819_SECTION_5&DocType=Catalog+Section&DocLang=English&src-supplier=Element14; ComponentLink5URL: http://uk.rs-online.com/webdocs/0fa3/0900766b80fa3622.pdf?src-supplier=RSComponents; ComponentLink5Description: http://uk.rs-online.com/webdocs/0fa3/0900766b80fa3622.pdf?src-supplier=RSComponents; ComponentLink6URL: https://www.te.com/commerce/DocumentDelivery/DDEController?Action=srchrtrv&DocNm=87224&DocType=Customer+Drawing&DocLang=English&src-supplier=Digi-Key; ComponentLink6Description: https://www.te.com/commerce/DocumentDelivery/DDEController?Action=srchrtrv&DocNm=87224&DocType=Customer+Drawing&DocLang=English&src-supplier=Digi-Key; ComponentLink7URL: https://www.alliedelec.com/m/d/7f3d665b792b1bf5eb695b1e5eb12d29.pdf?src-supplier=Allied+Electronics; ComponentLink7Description: https://www.alliedelec.com/m/d/7f3d665b792b1bf5eb695b1e5eb12d29.pdf?src-supplier=Allied+Electronics; Supplier Part Number 1: A26543-ND
L5 = SPM10040T-2R2M: IND 2.2UH 12A 7.5MOHM; Manufacturer: TDK; Categories: Inductors, Coils, Chokes; Type: Wirewound; Material - Core: Metal; Tolerance: ±20%; Current - Saturation: 12.2A; Shielding: Shielded; DC Resistance (DCR): 7.5 mOhm Max; Inductance Frequency - Test: 100kHz; Supplier 1: Digi-Key; Manufacturer Part Number: SPM10040T-2R2M; Stock 1: 2304; Pricing 1: 1=1.54, 10=1.43, 25=1.32, 50=1.1, 100=1.034, 250=0.924 (USD); Series: SPM; Packaging: Tape & Reel (TR); Part Status: Active; Current Rating: 12A; Q @ Freq: -; Frequency - Self Resonant: -; Ratings: -; Operating Temperature: -40°C ~ 125°C; Features: -; Mounting Type: Surface Mount; Package / Case: Nonstandard; Supplier Device Package: -; Size / Dimension: 0.421 L x 0.394 W (10.70mm x 10.00mm); Height - Seated (Max): 0.157 (4.00mm); ComponentLink1URL: https://product.tdk.com/info/en/catalog/datasheets/inductor_commercial_power_spm10040_en.pdf?src-supplier=Digi-Key; ComponentLink1Description: https://product.tdk.com/info/en/catalog/datasheets/inductor_commercial_power_spm10040_en.pdf?src-supplier=Digi-Key; Supplier Part Number 1: 445-175126-1-ND
R31 R40 R43 R45 R48 R50 = ERJ-6GEY0R00V: RES SMD 0 OHM JUMPER 1/8W 0805; Manufacturer: Panasonic; Rated Power: 0.125 W; Rated Current: 2 A; No. of Terminations: 2; Supplier 1: Digi-Key; Manufacturer Part Number: ERJ-6GEY0R00V; Stock 1: 1318594; Pricing 1: 1=0.1, 10=0.054, 25=0.0392, 50=0.03, 100=0.0221, 250=0.0168, 500=0.0135, 1000=0.0099 (USD); Technology: Thick Film; Operating Temp Range: -55 to +155 °C; Case Size: 0805 (2012 Metric); Dimension: 2 x 1.25 mm; Height - Max: 0.7 mm; ComponentLink1URL: http://www.farnell.com/datasheets/1678796.pdf?src-supplier=Element14; ComponentLink1Description: http://www.farnell.com/datasheets/1678796.pdf?src-supplier=Element14; ComponentLink2URL: http://industrial.panasonic.com/cdbs/www-data/pdf/RDA0000/AOA0000C301.pdf?src-supplier=Farnell; ComponentLink2Description: http://industrial.panasonic.com/cdbs/www-data/pdf/RDA0000/AOA0000C301.pdf?src-supplier=Farnell; ComponentLink3URL: http://industrial.panasonic.com/www-data/pdf/AOA0000/AOA0000CE1.pdf?src-supplier=Avnet; ComponentLink3Description: http://industrial.panasonic.com/www-data/pdf/AOA0000/AOA0000CE1.pdf?src-supplier=Avnet; ComponentLink4URL: http://industrial.panasonic.com/www-cgi/jvcr13pz.cgi?E+PZ+3+AOA0001+ERJ6GEY0R00V+7+WW?src-supplier=Jameco; ComponentLink4Description: http://industrial.panasonic.com/www-cgi/jvcr13pz.cgi?E+PZ+3+AOA0001+ERJ6GEY0R00V+7+WW?src-supplier=Jameco; ComponentLink5URL: http://industrial.panasonic.com/www-data/pdf/AOA0000/AOA0000CE1.pdf?src-supplier=Avnet+Europe; ComponentLink5Description: http://industrial.panasonic.com/www-data/pdf/AOA0000/AOA0000CE1.pdf?src-supplier=Avnet+Europe; ComponentLink6URL: http://industrial.panasonic.com/www-data/pdf/AOA0000/AOA0000CE1.pdf?src-supplier=Avnet+Asia; ComponentLink6Description: http://industrial.panasonic.com/www-data/pdf/AOA0000/AOA0000CE1.pdf?src-supplier=Avnet+Asia; Supplier Part Number 1: P0.0ACT-ND
R32 = ERJ-3EKF4222V: RES SMD 42.2K OHM 1% 1/10W 0603; Manufacturer: Panasonic; EDA / CAD Models: Download from Accelerated Designs; Power (Watts): 0.1W, 1/10W; Temperature Coefficient: ±100ppm/°C; Online Catalog: ERJ Series; Kits: RSM4H-ND  - RES KIT 10K-97.6K 1/10W 4800PCS; Other Names: ERJ-3EKF4222 ERJ3EKF4222 P42.2KHCT; Supplier 1: Digi-Key; Manufacturer Part Number: ERJ-3EKF4222V; Stock 1: 6649; Pricing 1: 1=0.1, 10=0.032, 100=0.013, 1000=0.0058, 2500=0.0051 (USD); Standard Package: 1; Category: Resistors; Family: Chip Resistor - Surface Mount; Series: ERJ; Packaging: Cut Tape (CT); Tolerance: ±1%; Composition: Thick Film; Features: Automotive AEC-Q200; Operating Temperature: -55°C ~ 155°C; Package / Case: 0603 (1608 Metric); Supplier Device Package: 0603; Size / Dimension: 0.063" L x 0.031" W (1.60mm x 0.80mm); Height: 0.022" (0.55mm); Number of Terminations: 2; ComponentLink1URL: http://www.farnell.com/datasheets/1678782.pdf?src-supplier=Element14; ComponentLink1Description: http://www.farnell.com/datasheets/1678782.pdf?src-supplier=Element14; ComponentLink2URL: http://www.farnell.com/datasheets/1911175.pdf?src-supplier=Farnell; ComponentLink2Description: http://www.farnell.com/datasheets/1911175.pdf?src-supplier=Farnell; ComponentLink3URL: http://industrial.panasonic.com/www-data/pdf/AOA0000/AOA0000CE2.pdf?src-supplier=Avnet+Europe; ComponentLink3Description: http://industrial.panasonic.com/www-data/pdf/AOA0000/AOA0000CE2.pdf?src-supplier=Avnet+Europe; ComponentLink4URL: https://www.alliedelec.com/m/d/623f45ff1957d936ff56d46fd1c28cac.pdf?src-supplier=Allied+Electronics; ComponentLink4Description: https://www.alliedelec.com/m/d/623f45ff1957d936ff56d46fd1c28cac.pdf?src-supplier=Allied+Electronics; ComponentLink5URL: http://industrial.panasonic.com/www-data/pdf/AOA0000/AOA0000CE2.pdf?src-supplier=Avnet+Asia; ComponentLink5Description: http://industrial.panasonic.com/www-data/pdf/AOA0000/AOA0000CE2.pdf?src-supplier=Avnet+Asia; ComponentLink6URL: http://industrial.panasonic.com/www-data/pdf/AOA0000/AOA0000CE2.pdf?src-supplier=Avnet; ComponentLink6Description: http://industrial.panasonic.com/www-data/pdf/AOA0000/AOA0000CE2.pdf?src-supplier=Avnet; ComponentLink7URL: http://www.mouser.com/ds/2/315/AOA0000C283-1093288.pdf?src-supplier=Mouser; ComponentLink7Description: http://www.mouser.com/ds/2/315/AOA0000C283-1093288.pdf?src-supplier=Mouser; ComponentLink8URL: http://www.farnell.com/datasheets/426256.pdf?src-supplier=Element14; ComponentLink8Description: http://www.farnell.com/datasheets/426256.pdf?src-supplier=Element14; Supplier Part Number 1: P42.2KHCT-ND
R33 = ERA-3AEB102V: RES SMD 1K OHM 0.1% 1/10W 0603; Manufacturer: Panasonic; Resistor Element Type: Thin Film; Product Range: PANASONIC - ERA Series Metal Film Chip Resistor; Power Rating: 100mW; Resistor Case Style: 0603 [1608 Metric]; Temperature Coefficient: ± 25ppm/°C; Voltage Rating: 75V; No. of Pins: 2; SVHC: No SVHC (16-Jun-2014); Reel Quantity: 5000; Supplier 1: Digi-Key; Manufacturer Part Number: ERA-3AEB102V; Stock 1: 455914; Pricing 1: 1=0.34, 10=0.286, 100=0.1116, 1000=0.0467, 2500=0.0428 (USD); Resistance Tolerance: ± 0.1%; Resistor Element Material: Thin Film; Operating Temperature Max: 155°C; Operating Temperature Min: -55°C; Operating Temperature Range: -55°C to +155°C; Package / Case: 0603; Packaging: Reel; Resistor Mounting: SMD; Series: ERA; ComponentLink1URL: http://uk.rs-online.com/webdocs/148c/0900766b8148c48a.pdf?src-supplier=RSComponents; ComponentLink1Description: http://uk.rs-online.com/webdocs/148c/0900766b8148c48a.pdf?src-supplier=RSComponents; ComponentLink2URL: https://industrial.panasonic.com/cdbs/www-data/pdf/RDM0000/AOA0000C307.pdf?src-supplier=Mouser; ComponentLink2Description: https://industrial.panasonic.com/cdbs/www-data/pdf/RDM0000/AOA0000C307.pdf?src-supplier=Mouser; ComponentLink3URL: https://industrial.panasonic.com/cdbs/www-data/pdf/RDM0000/AOA0000C307.pdf?src-supplier=Distrelec; ComponentLink3Description: https://industrial.panasonic.com/cdbs/www-data/pdf/RDM0000/AOA0000C307.pdf?src-supplier=Distrelec; ComponentLink4URL: http://www.alliedelec.com/m/d/b6b0537e86f421aa7f5975bb1d8f429a.pdf?src-supplier=Allied+Electronics; ComponentLink4Description: http://www.alliedelec.com/m/d/b6b0537e86f421aa7f5975bb1d8f429a.pdf?src-supplier=Allied+Electronics; ComponentLink5URL: http://www.farnell.com/datasheets/2059650.pdf?src-supplier=Element14; ComponentLink5Description: http://www.farnell.com/datasheets/2059650.pdf?src-supplier=Element14; ComponentLink6URL: http://www.farnell.com/datasheets/485442.pdf?src-supplier=Element14; ComponentLink6Description: http://www.farnell.com/datasheets/485442.pdf?src-supplier=Element14; ComponentLink7URL: http://industrial.panasonic.com/www-data/pdf/AOA0000/AOA0000CE26.pdf?src-supplier=Future+Electronics; ComponentLink7Description: http://industrial.panasonic.com/www-data/pdf/AOA0000/AOA0000CE26.pdf?src-supplier=Future+Electronics; ComponentLink8URL: http://www.farnell.com/datasheets/2052875.pdf?src-supplier=Farnell; ComponentLink8Description: http://www.farnell.com/datasheets/2052875.pdf?src-supplier=Farnell; ComponentLink9URL: https://industrial.panasonic.com/cdbs/www-data/pdf/RDM0000/AOA0000C307.pdf?src-supplier=Avnet; ComponentLink9Description: https://industrial.panasonic.com/cdbs/www-data/pdf/RDM0000/AOA0000C307.pdf?src-supplier=Avnet; ComponentLink10URL: http://www.farnell.com/datasheets/485442.pdf?src-supplier=Farnell; ComponentLink10Description: http://www.farnell.com/datasheets/485442.pdf?src-supplier=Farnell; ComponentLink11URL: http://industrial.panasonic.com/www-data/pdf/AOA0000/AOA0000CE26.pdf?src-supplier=Avnet+Europe; ComponentLink11Description: http://industrial.panasonic.com/www-data/pdf/AOA0000/AOA0000CE26.pdf?src-supplier=Avnet+Europe; ComponentLink12URL: http://www.produktinfo.conrad.com/datenblaetter/450000-474999/450752-da-01-en-WIDERSTAND_0603_ERA.pdf?src-supplier=Conrad; ComponentLink12Description: http://www.produktinfo.conrad.com/datenblaetter/450000-474999/450752-da-01-en-WIDERSTAND_0603_ERA.pdf?src-supplier=Conrad; Supplier Part Number 1: P1.0KDBCT-ND
R34 R59 R60 = ERJ3EKF1000V: RES SMD 100 OHM 1% 1/10W 0603; Manufacturer: Panasonic; Rated Power: 0.1 W; Temp Coefficient: ±100 ppm/°C; Supplier 1: Digi-Key; Manufacturer Part Number: ERJ3EKF1000V; Stock 1: 1061558; Pricing 1: 1=0.1, 10=0.065, 100=0.0266, 1000=0.0119, 2500=0.0104 (USD); Size Code: 0603; Tolerance (%): ±1 %; ComponentLink1URL: http://industrial.panasonic.com/www-data/pdf/AOA0000/AOA0000CE2.pdf?src-supplier=Avnet; ComponentLink1Description: http://industrial.panasonic.com/www-data/pdf/AOA0000/AOA0000CE2.pdf?src-supplier=Avnet; ComponentLink2URL: http://www.alliedelec.com/m/d/623f45ff1957d936ff56d46fd1c28cac.pdf?src-supplier=Allied+Electronics; ComponentLink2Description: http://www.alliedelec.com/m/d/623f45ff1957d936ff56d46fd1c28cac.pdf?src-supplier=Allied+Electronics; ComponentLink3URL: http://industrial.panasonic.com/cdbs/www-data/pdf/RDA0000/AOA0000C304.pdf?src-supplier=Element14; ComponentLink3Description: http://industrial.panasonic.com/cdbs/www-data/pdf/RDA0000/AOA0000C304.pdf?src-supplier=Element14; ComponentLink4URL: http://industrial.panasonic.com/www-data/pdf/AOA0000/AOA0000CE2.pdf?src-supplier=Element14; ComponentLink4Description: http://industrial.panasonic.com/www-data/pdf/AOA0000/AOA0000CE2.pdf?src-supplier=Element14; ComponentLink5URL: http://www.mouser.com/ds/2/315/AOA0000C86-911473.pdf?src-supplier=Mouser; ComponentLink5Description: http://www.mouser.com/ds/2/315/AOA0000C86-911473.pdf?src-supplier=Mouser; ComponentLink6URL: http://www.jameco.com/Jameco/Products/ProdDS/1987450.pdf?src-supplier=Jameco; ComponentLink6Description: http://www.jameco.com/Jameco/Products/ProdDS/1987450.pdf?src-supplier=Jameco; ComponentLink7URL: http://industrial.panasonic.com/www-data/pdf/AOA0000/AOA0000CE2.pdf?src-supplier=Avnet+Europe; ComponentLink7Description: http://industrial.panasonic.com/www-data/pdf/AOA0000/AOA0000CE2.pdf?src-supplier=Avnet+Europe; ComponentLink8URL: http://www.farnell.com/datasheets/1678782.pdf?src-supplier=Element14; ComponentLink8Description: http://www.farnell.com/datasheets/1678782.pdf?src-supplier=Element14; Supplier Part Number 1: P100HCT-ND